# Altium schematic sheet relay.SchDoc
size A4; Engineer: Amir Hossein Jobeiri; Organization: Simaran; SheetNumber: 5; SheetTotal: 24
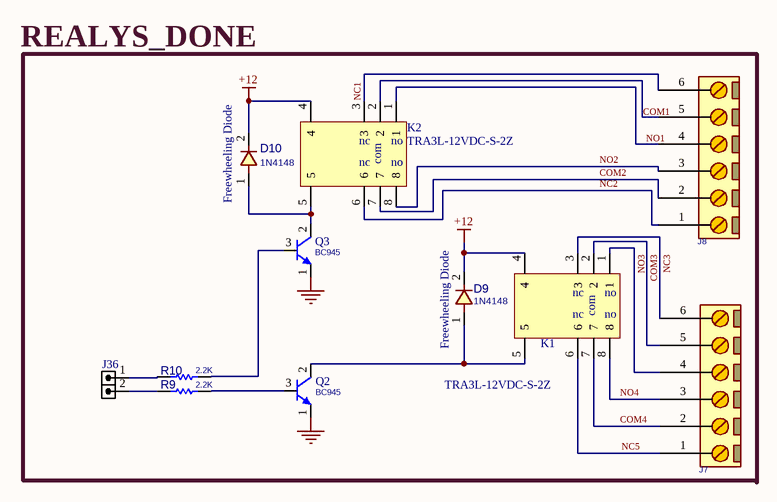
[diagram p0: relay.SchDoc]

## Parts
D9  1N4148  [D_AX02_DO35]
D10  1N4148  [D_AX02_DO35]
J7  CONN_TB6  [TBG_6]  (value not drawn)
J8  CONN_TB6  [TBG_6]  (value not drawn)
J36  HDRM2  [HDR_M_1X2]  (value not drawn)
K1  TRA3L-12VDC-S-2Z  [TR3_RELAY_TIANBO]
K2  TRA3L-12VDC-S-2Z  [TR3_RELAY_TIANBO]
Q2  BC945  [TO92_3]
Q3  BC945  [TO92_3]
R9  2.2K  [R025W_AX04]
R10  2.2K  [R025W_AX04]

## Nets
+12: D9.2 D10.2 K1.4 K2.4
GND: Q2.1(E) Q3.1(E)
COM2: J8.2 K2.7
COM3: J7.5 K1.2
COM4: J7.2 K1.7
NC1: J8.6 K2.3
NC2: J8.1 K2.6
NC3: J7.6 K1.3
NC5: J7.1 K1.6
NO2: J8.3 K2.8
NO3: J7.4 K1.1
NO4: J7.3 K1.8
NetD9_1: D9.1 K1.5 Q2.2(C)
NetD10_1: D10.1 K2.5 Q3.2(C)
NetJ8_4: J8.4 K2.1
NetJ8_5: J8.5 K2.2
NetJ36_1: J36.1 R10.1
NetJ36_2: J36.2 R9.1
NetQ2_3: Q2.3(B) R9.2
NetQ3_3: Q3.3(B) R10.2

## Notes on the sheet
- REALYS_DONE
- (near D10) Freewheeling Diode
- (near D9) Freewheeling Diode
- Labels drawn without touching a wire or pin: COM1, NO1
- (in symbol RELAY_TRA3) nc; no; com

## Library data of the parts
D9 D10 = DIODE_THD_1N4148_DO35: DIODE, FAST SWTICHING, THD; DESC: DESCRIPTION; PARAM: 75V; PARAM2: 0.3A; MANF: MANF; ASSEMBLY: ASSEMBLY; PRICE: PRICE; MANF_P#: 1N4148; VALUE: 1N4148
J7 J8 = CONN_TB6: CONN, TERMINAL BLOCK, 5.08mm pitch; VALUE: CONN_TB6
J36 = HDR_M_1X2: CONN, HEADER, Male, pitch: 2.54mm, 2POS; VALUE: HDRM2
K1 K2 = RELAY_TRA3: MANF: TIANBO; VALUE: TRA3L-12VDC-S-2Z; MANF_P#: *; PARAM1: *; PARAM2: *
Q2 Q3 = NPN_BC945_TO92: BJT, NPN, 50v, 0.15A, THD, TO92, BC945; PARAM2: 250mW; MANF_P#: 2SC945, BC945; PARAM: 50v, 0.15A; MANF: -; VALUE: BC945
R9 R10 = RES_THD: RESISTOR, THD; MANF_P#: RK73H1ETTP4701F; MANF: KOA SPEER; PARAM: 0.063W; DESC: DESCRIPTION; DIST#: MOUSER; PARAM2: 1%; ASSEMBLY: ASSEMBLY; PRICE: 100= 0.5$; VALUE: 2.2K